# Altium schematic sheet LED_Matrix.SchDoc
size A4; SheetNumber: 2; SheetTotal: 4
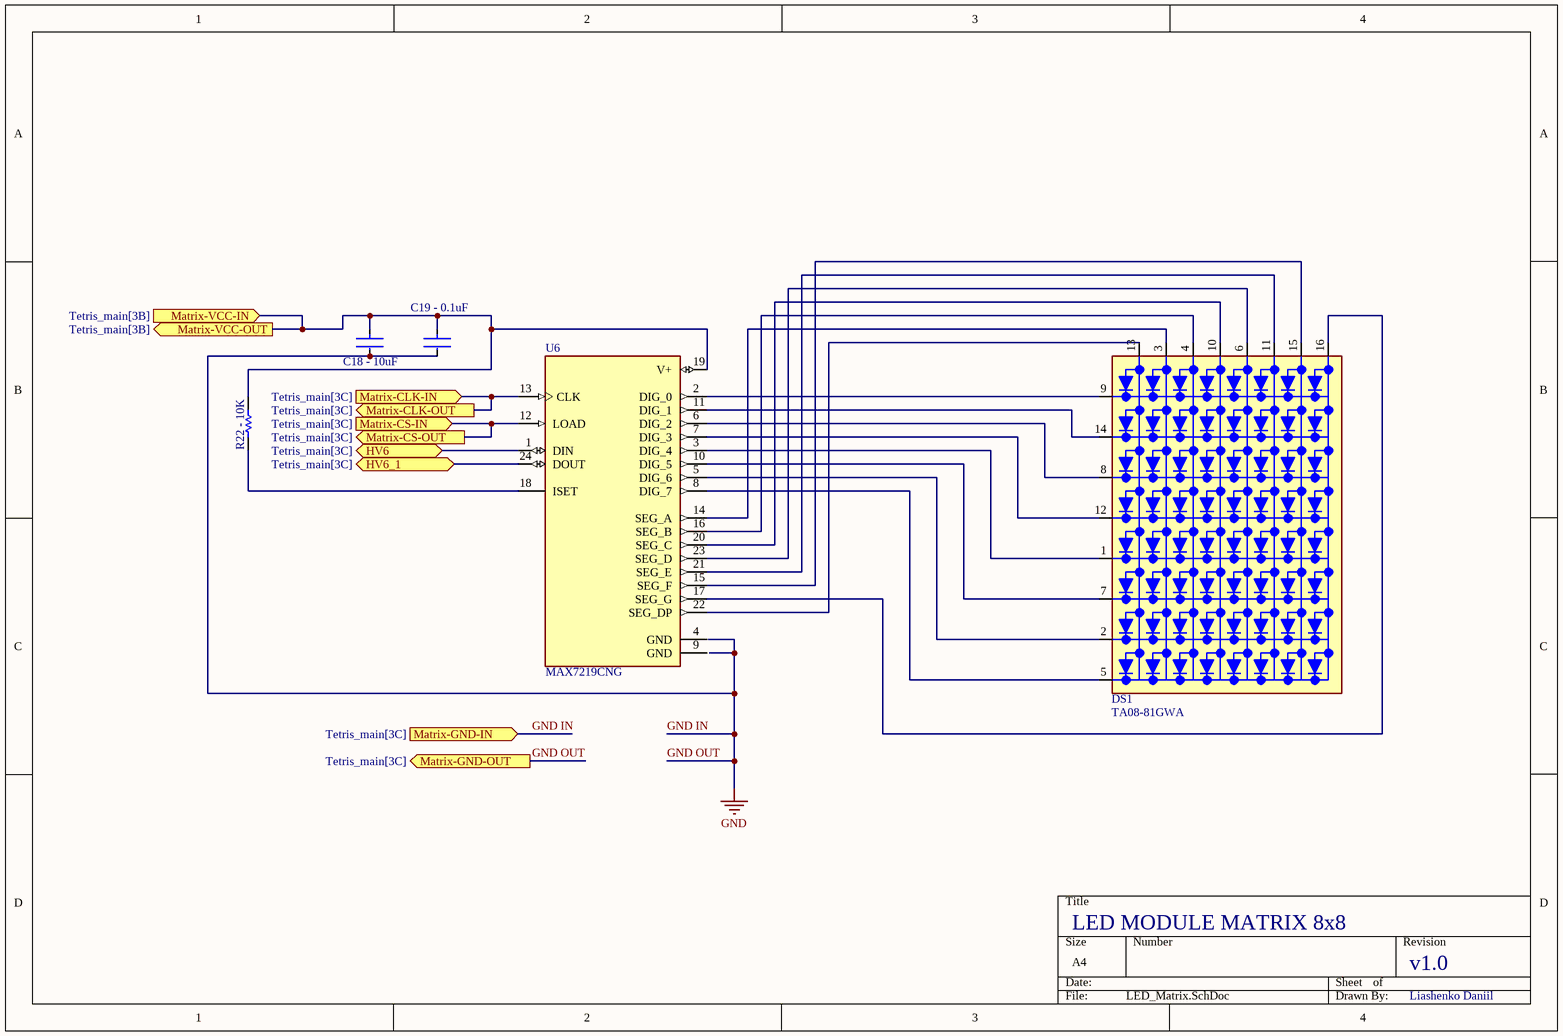
[diagram p0: LED_Matrix.SchDoc]

## Parts
C18_-_10uF  GRM188R60J106ME47D  [FP-GRM188-0_1-e0_2_0_55-IPC_A]  (value not drawn)
C19_-_0.1uF  CC0603KRX7R7BB104  [FP-CC0603-DA-MFG]  (value not drawn)
DS1  TA08-81GWA  [DISPLAY_TA08-81GWA]
R22_-_10K  RC0603JR-074K7L  [RESC1608X55X25ML10T15]  (value not drawn)
U6  MAX7219CNG  [DIP762W47P254L3054H457Q24B]

## Ports
HV6 (bidir, see Tetris_main[3C]), HV6_1 (bidir, see Tetris_main[3C]), Matrix-CLK-IN (in, see Tetris_main[3C]), Matrix-CLK-OUT (out, see Tetris_main[3C]), Matrix-CS-IN (in, see Tetris_main[3C]), Matrix-CS-OUT (out, see Tetris_main[3C]), Matrix-GND-IN (in, see Tetris_main[3C]), Matrix-GND-OUT (out, see Tetris_main[3C]), Matrix-VCC-IN (in, see Tetris_main[3B]), Matrix-VCC-OUT (out, see Tetris_main[3B])

## Nets
GND IN: C18_-_10uF.2 C19_-_0.1uF.2 ; port Matrix-GND-IN, port Matrix-GND-OUT  [also labelled GND, GND OUT]
HV6: U6.1(DIN) ; port HV6
HV6_1: U6.24(DOUT) ; port HV6_1
Matrix-CLK-IN: U6.13(CLK) ; port Matrix-CLK-IN, port Matrix-CLK-OUT
Matrix-CS-IN: U6.12(LOAD) ; port Matrix-CS-IN, port Matrix-CS-OUT
Matrix-VCC-IN: C18_-_10uF.1 C19_-_0.1uF.1 R22_-_10K.2 U6.19(V+) ; port Matrix-VCC-IN, port Matrix-VCC-OUT
NetDS1_1: DS1.1(CATHODE_ROW_5) U6.3(DIG_4)
NetDS1_2: DS1.2(CATHODE_ROW_7) U6.5(DIG_6)
NetDS1_3: DS1.3(ANODE_COLUMN_2) U6.14(SEG_A)
NetDS1_4: DS1.4(ANODE_COLUMN_3) U6.16(SEG_B)
NetDS1_5: DS1.5(CATHODE_ROW_8) U6.8(DIG_7)
NetDS1_6: DS1.6(ANODE_COLUMN_5) U6.23(SEG_D)
NetDS1_7: DS1.7(CATHODE_ROW_6) U6.10(DIG_5)
NetDS1_8: DS1.8(CATHODE_ROW_3) U6.6(DIG_2)
NetDS1_9: DS1.9(CATHODE_ROW_1) U6.2(DIG_0)
NetDS1_10: DS1.10(ANODE_COLUMN_4) U6.20(SEG_C)
NetDS1_11: DS1.11(ANODE_COLUMN_6) U6.21(SEG_E)
NetDS1_12: DS1.12(CATHODE_ROW_4) U6.7(DIG_3)
NetDS1_13: DS1.13(ANODE_COLUMN_1) U6.22(SEG_DP)
NetDS1_14: DS1.14(CATHODE_ROW_2) U6.11(DIG_1)
NetDS1_15: DS1.15(ANODE_COLUMN_7) U6.15(SEG_F)
NetDS1_16: DS1.16(ANODE_COLUMN_8) U6.17(SEG_G)
NetR22_-_10K_1: R22_-_10K.1 U6.18(ISET)

Not connected (* = marked no-connect by the designer): U6 4(GND) 9(GND)

## Notes on the sheet
- LED MODULE MATRIX 8x8
- v1.0
- Liashenko Daniil

## Library data of the parts
C18_-_10uF = CMP-2006-02792-2: Chip Multilayer Ceramic Capacitors for General Purpose, 0603, 10uF, X5R, 15%, 20%, 6.3V; Packaging: Tape and Reel; Voltage Rating (DC): 6.3V; Width: 0.031inch; Termination: SMD/SMT; Dielectric: X5R; Package Quantity: 4000; Voltage Rating: 6.3V; Capacitance: 10uF; Case/Package: 0603; Min Operating Temperature: -55°C; Voltage: 6.3V; Length: 1.6mm; Thickness: 0.035inch; Lead Free: Lead Free; Depth: 0.8mm; Case Code (Imperial): 0603; Max Operating Temperature: 85°C; Material: Ceramic; Height: 0.8mm; Tolerance: 20%; Mount: Surface Mount; REACH SVHC: No SVHC; Radiation Hardening: No; Case Code (Metric): 1608
C19_-_0.1uF = CMP-2000-05002-2: CAP CER 0.1UF 16V X7R 0603; Manufacturer: YAGEO; Tolerance: 0.1; Value: 100 nF; Temperature Coefficient: 15%; Material: Ceramic; Voltage Rating: 16 V; Package: CC0603-DA; ComponentLink2Description: Datasheet; Octopart: https://octopart.com/cc0603krx7r7bb104-yageo-192941; Temperature Range High: +125°C; Digikey Description: CAP CER 0.1UF 16V X7R 0603; Voltage: 16 V; Device Class L2: Capacitors; Height: 0.9mm; Temperature: -55°C to +125°C; Manufacturer Part Number: CC0603KRX7R7BB104; Device Class L1: Passive Components; Device Class L3: Ceramic Capacitors; ComponentLink2URL: http://www.yageo.com/documents/recent/UPY-GPHC_X7R_6.3V-to-50V_18.pdf; Footprint Url: http://www.yageo.com/exep/pages/download/literatures/UPY-C_GEN_24.pdf; RoHS: TRUE; Temperature Range Low: -55°C; Temperature Characteristic: X7R; Lead Free: Yes; Capacitance: 100 nF; Category: Cap; Mouser Description: Multilayer Ceramic Capacitor, CC Series, 0.1 - F, - 10%, X7R, 16 V, 0603 [1608 Metric]; Automotive: No
DS1 = CMP-007-00037-1: DISPLAY, DOT MATRIX, 0.8, 8X8, GREEN; Display Dots x Lines: 8 x 8; LED Colour: Gr; MF: Kingbright; Case/Package: DIP-16 Kingbright; Price: None; SnapEDA_Link: https://www.snapeda.com/parts/TA08-81GWA/Kingbright/view-part/?ref=snap; Design Item ID: TA08-81GWA; MP: TA08-81GWA; Check_prices: https://www.snapeda.com/parts/TA08-81GWA/Kingbright/view-part/?ref=eda; Availability: Not in stock; Value: *; Pins: 16; Component Type: Standard; Source: TA08-81GWA.SchLib
R22_-_10K = CMP-2000-05024-1: Chip Resistor, 4.7 KOhm, +/- 5%, 100 mW, -55 to 155 degC, 0603 (1608 Metric), RoHS, Tape and Reel; Manufacturer: Yageo; Resistance: 4.7kOhms; Temperature Coefficient: 100PPM/C; Power Rating: 100mW; Voltage Rating: 50V; Operating Temperature Range: -55Cto+155C; Case Code - mm: 1608; Tolerance: 5%; Product: ThickFilmResistorsGeneralPurpose; Case Code - in: 0603; Datasheet URL: http://www.yageo.com/documents/recent/PYu-RC_Group_51_RoHS_L_04.pdf; Package Reference: 603; Datasheet Version: Rev. 4, 02/2016; Package Description: 2-Pin Surface Mount Device, Body 1.6 x 0.8 mm; Manufacturer URL: http://www.yageo.com/; Series: RC; Packaging: Reel; Termination Style: SMD/SMT
U6 = CMP-051-000000-9: Value: *; Component Type: Standard; MP: MAX7219CNG; Package: None; Availability: Unavailable; Source: MAX7219CNG.SchLib; Price: None; Pin Count: 24; Design Item ID: MAX7219CNG